# Altium schematic sheet Temp-Humid Sensor.SchDoc
size A4; SheetNumber: 7; SheetTotal: 7
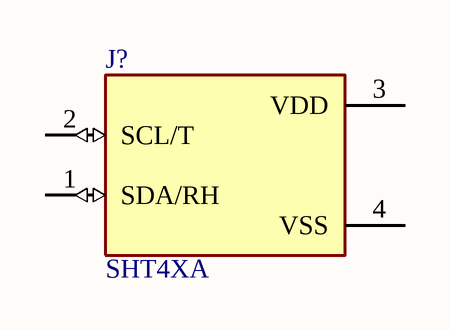
[diagram p0: Temp-Humid Sensor.SchDoc]

## Parts
J?  SHT4XA  [SHT4XA]

## Nets

Not connected (* = marked no-connect by the designer): J? 1(SDA/RH) 2(SCL/T) 3(VDD) 4(VSS)

## Library data of the parts
J? = CMP-163-000000-1: Automotive Grade Relative Humidity Temperature Sensor, Â±3 %RH, Â±0.3 Â°C; MF: Sensirion; MP: SHT40A-AD1B-R3; Component Type: Standard; Pin Count: 4; SnapEDA_Link: https://www.snapeda.com/parts/SHT40A-AD1B-R3/Sensirion/view-part/?ref=snap; Price: None; Package: DFN-4 Sensirion; Availability: Not in stock; Check_prices: https://www.snapeda.com/parts/SHT40A-AD1B-R3/Sensirion/view-part/?ref=eda; Design Item ID: SHT4XA; Source: SHT4XA.SchLib; Value: *